# Altium schematic sheet leg_group.SchDoc: Leg group
size A4; Organization: GPA Robotics; DocumentNumber: 8; Revision: REV 0; SheetNumber: 8; SheetTotal: 11
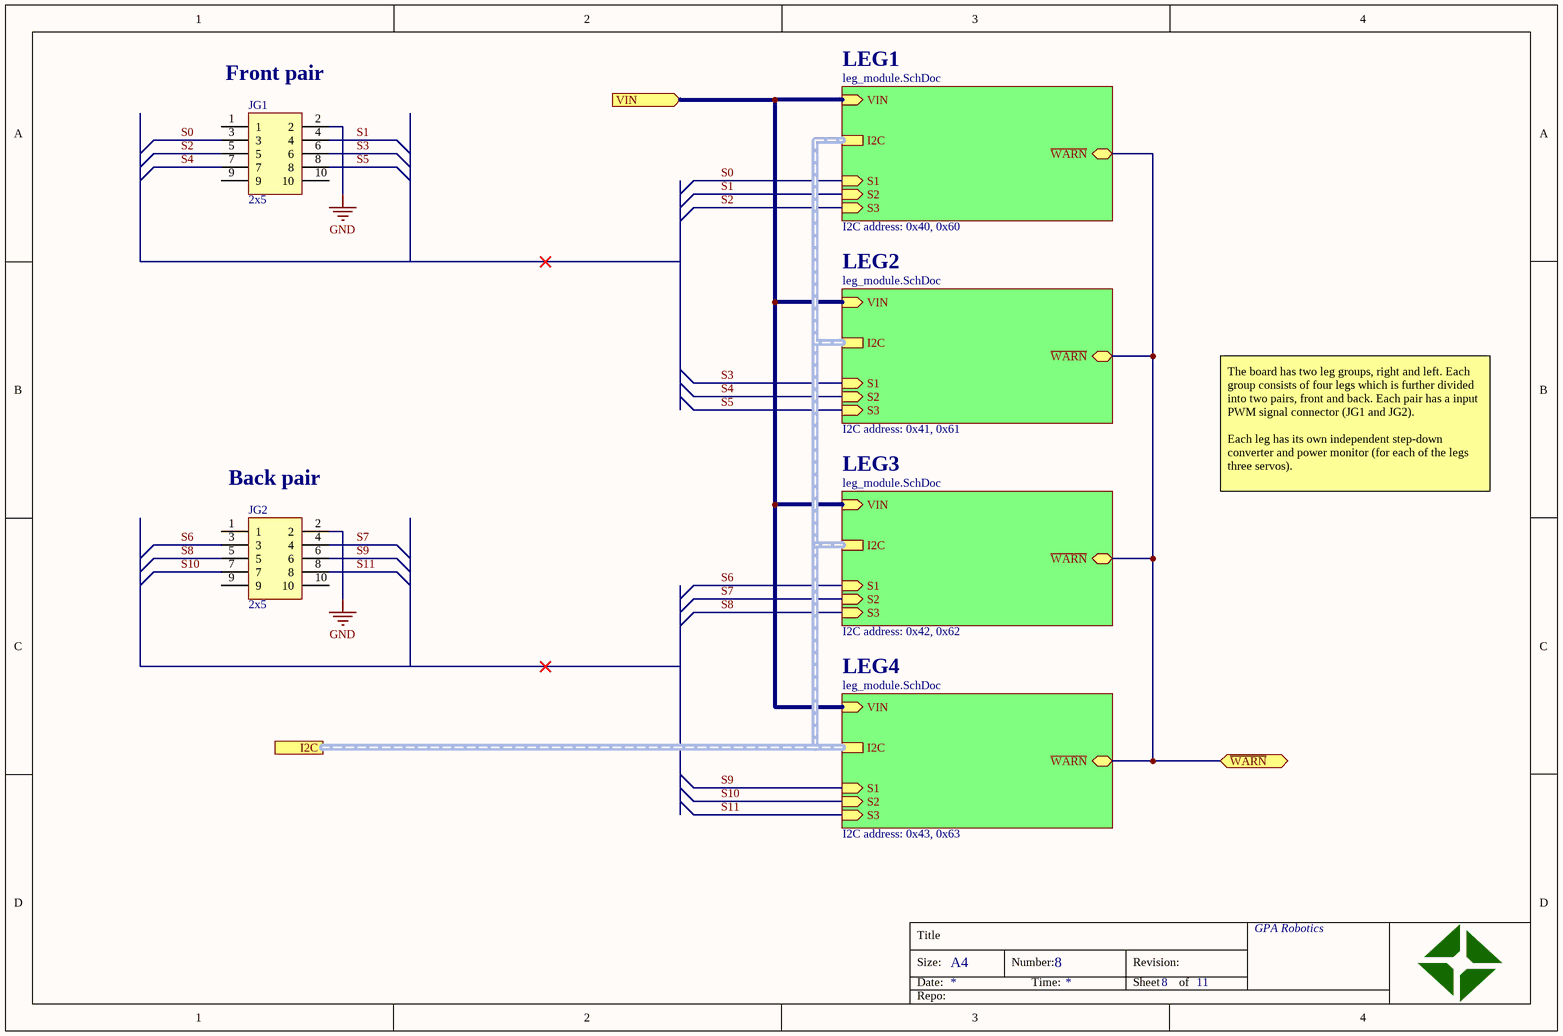
[diagram p0: leg_group.SchDoc]

## Parts
JG1  2x5  [hdr_2x5_50mil]
JG2  2x5  [hdr_2x5_50mil]

## Sub-sheets
LEG1 = leg_module.SchDoc: S1 (in), S2 (in), S3 (in), VIN (in), ~{WARN} (bidir), I2C (harness I2C)  | I2C address: 0x40, 0x60
LEG2 = leg_module.SchDoc: S1 (in), S2 (in), S3 (in), VIN (in), ~{WARN} (bidir), I2C (harness I2C)  | I2C address: 0x41, 0x61
LEG3 = leg_module.SchDoc: S1 (in), S2 (in), S3 (in), VIN (in), ~{WARN} (bidir), I2C (harness I2C)  | I2C address: 0x42, 0x62
LEG4 = leg_module.SchDoc: S1 (in), S2 (in), S3 (in), VIN (in), ~{WARN} (bidir), I2C (harness I2C)  | I2C address: 0x43, 0x63

## Ports
I2C (harness I2C), VIN (in), ~{WARN} (bidir)

## Nets
GND: JG1.2 JG2.2
~{WARN}: port ~{WARN}, sheet LEG1/~{WARN}, sheet LEG2/~{WARN}, sheet LEG3/~{WARN}, sheet LEG4/~{WARN}
S0: JG1.3 ; sheet LEG1/S1
S1: JG1.4 ; sheet LEG1/S2
S2: JG1.5 ; sheet LEG1/S3
S3: JG1.6 ; sheet LEG2/S1
S4: JG1.7 ; sheet LEG2/S2
S5: JG1.8 ; sheet LEG2/S3
S6: JG2.3 ; sheet LEG3/S1
S7: JG2.4 ; sheet LEG3/S2
S8: JG2.5 ; sheet LEG3/S3
S9: JG2.6 ; sheet LEG4/S1
S10: JG2.7 ; sheet LEG4/S2
S11: JG2.8 ; sheet LEG4/S3
VIN: port VIN, sheet LEG1/VIN, sheet LEG2/VIN, sheet LEG3/VIN, sheet LEG4/VIN

Not connected (* = marked no-connect by the designer): JG1 1 9 10; JG2 1 9 10

## Buses and harness runs
harness port I2C = sheet LEG1/I2C = sheet LEG2/I2C = sheet LEG3/I2C = sheet LEG4/I2C

## Notes on the sheet
- (near JG1) Front pair
- (near JG2) Back pair
- The board has two leg groups, right and left. Each group consists of four legs which is further divided into two pairs, front and back. Each pair has a input PWM signal connector (JG1 and JG2).
  Each leg has its own independent step-down converter and power monitor (for each of the legs three servos).
- Title
- Size:
- Date:
- A4
- Number:
- Time:
- Revision:
- Sheet
- of
- Repo:

## Library data of the parts
JG1 JG2 = hdr_2x5: 2x5 Header